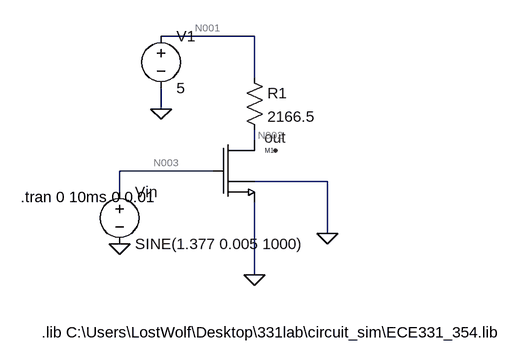
[diagram p0: schematic lab1_nmos_sine.asc]
lab1_nmos_sine.asc, the LTspice schematic file:
Version 4
SHEET 1 880 680
WIRE 176 -48 32 -48
WIRE 176 16 176 -48
WIRE 32 64 32 32
WIRE 176 112 176 96
WIRE 112 160 -32 160
WIRE 288 176 176 176
WIRE -32 192 -32 160
WIRE 288 256 288 176
WIRE 176 320 176 208
FLAG 176 320 0
FLAG 32 64 0
FLAG 288 256 0
FLAG 208 128 out
FLAG -32 272 0
SYMBOL ALD1101 112 112 R0
SYMATTR InstName M1
SYMATTR SpiceModel ""
SYMATTR SpiceLine ""
SYMATTR Value ALD1101
SYMATTR Value2 W=1.379e-3 L=1E-6
SYMBOL res 160 0 R0
SYMATTR InstName R1
SYMATTR Value 2166.5
SYMBOL voltage 32 -64 R0
WINDOW 123 0 0 Left 2
WINDOW 39 0 0 Left 2
SYMATTR InstName V1
SYMATTR Value 5
SYMBOL voltage -32 176 R0
WINDOW 123 0 0 Left 2
WINDOW 39 0 0 Left 2
SYMATTR InstName Vin
SYMATTR Value SINE(1.377 0.005 1000)
TEXT -152 408 Left 2 !.lib C:\\Users\\LostWolf\\Desktop\\331lab\\circuit_sim\\ECE331_354.lib
TEXT -184 200 Left 2 !.tran 0 10ms 0 0.01

The netlist it stands for:
* lab1_nmos_sine.asc
M1 N002 N003 0 0 ALD1101 W=1.379e-3 L=1E-6
R1 N001 N002 2166.5
V1 N001 0 5
Vin N003 0 SINE(1.377 0.005 1000)
.model NMOS NMOS
.model PMOS PMOS
.lib standard.mos
.lib C:\Users\LostWolf\Desktop\331lab\circuit_sim\ECE331_354.lib
.tran 0 10ms 0 0.01
.backanno
.end

* Results of the author's LTspice run, read from the files saved beside the schematic
* Operating Point, zero values left out:
*   V(n002) = 2.725 V
*   V(n003) = 1.377 V
*   V(n001) = 5 V
*   Id(M1) = 1.05 mA
*   Ib(M1) = -2.743 pA
*   Is(M1) = -1.05 mA
*   I(R1) = 1.05 mA
*   I(V1) = -1.05 mA
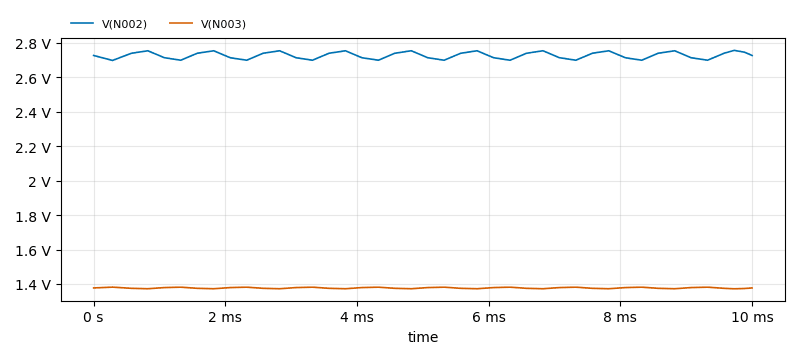
[diagram p1: Transient Analysis of lab1_nmos_sine.asc, plotted from the saved traces]
* Transient Analysis, 1 run:
*   V(N002): min 2.697 V, max 2.755 V, average 2.725 V, rms 2.726 V, last 2.725 V
*   V(N003): min 1.372 V, max 1.382 V, average 1.377 V, rms 1.377 V, last 1.377 V